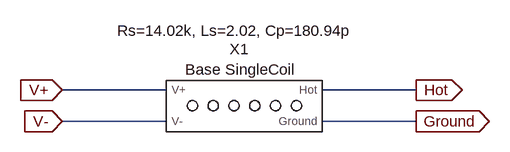
[diagram p0: schematic DiMarzio_Utopia_Middle_DP288F.asc]
DiMarzio_Utopia_Middle_DP288F.asc, the LTspice schematic file:
Version 4
SHEET 1 880 680
WIRE 48 144 -112 144
WIRE 432 144 288 144
WIRE 48 192 -112 192
WIRE 432 192 288 192
FLAG -112 144 V+
IOPIN -112 144 In
FLAG -112 192 V-
IOPIN -112 192 In
FLAG 432 144 Hot
IOPIN 432 144 Out
FLAG 432 192 Ground
IOPIN 432 192 Out
SYMBOL Base_SingleCoil 160 160 R0
WINDOW 39 -6 -92 Bottom 2
SYMATTR SpiceLine Rs=14.02k, Ls=2.02, Cp=180.94p
SYMATTR InstName X1

The netlist it stands for:
* DiMarzio_Utopia_Middle_DP288F.asc
XX1 V+ V- Hot Ground Base SingleCoil Rs=14.02k, Ls=2.02, Cp=180.94p  ; pins V+ V- Hot Ground
.backanno
.end